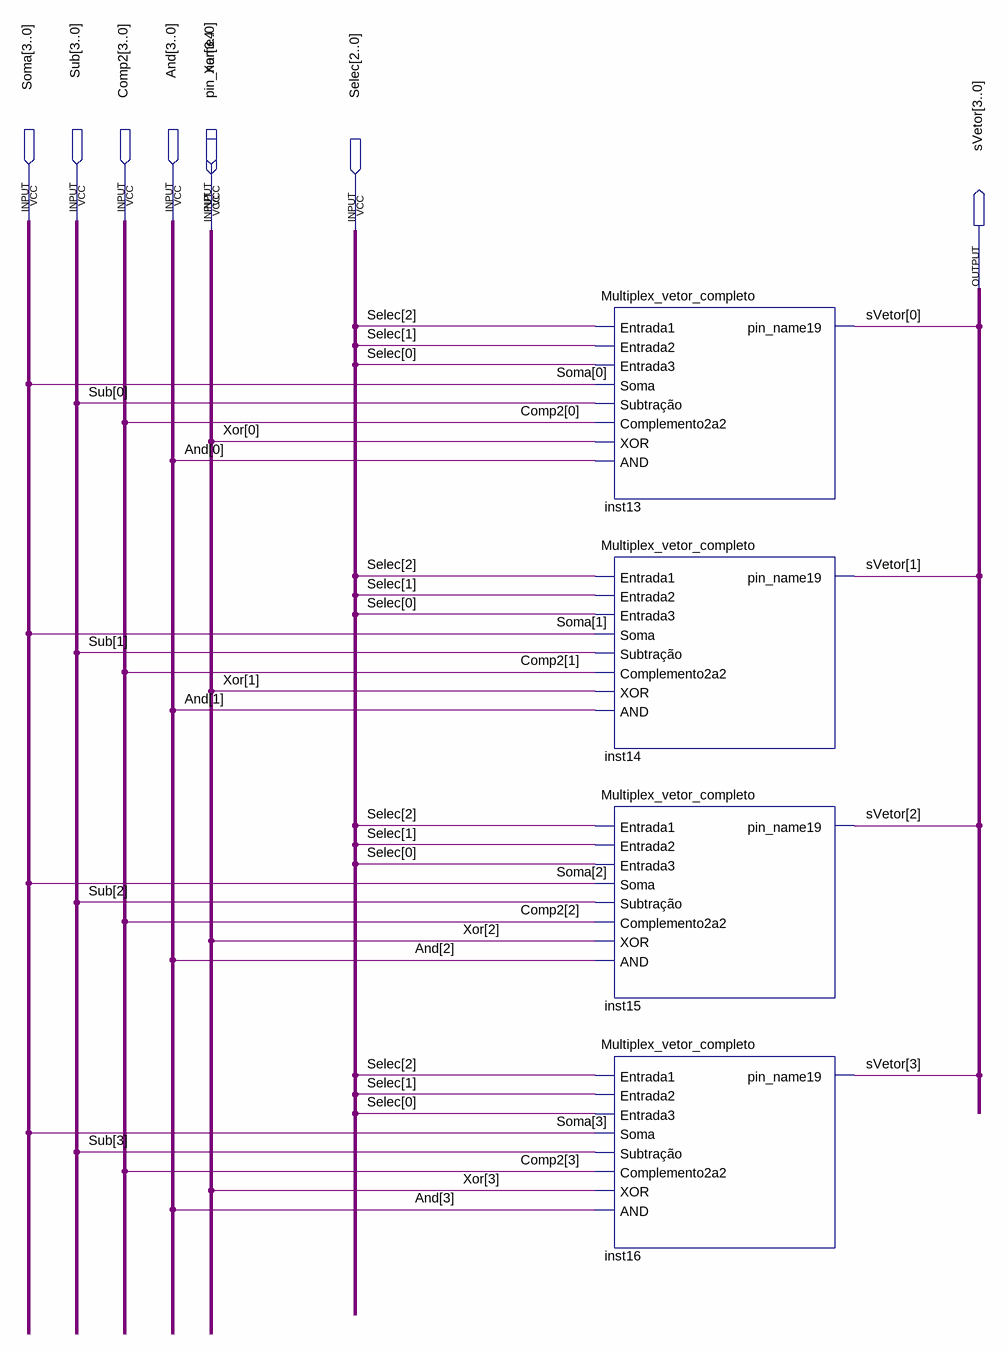
[diagram p0: schematic sheet]
// Quartus schematic Multiplex_vetor_real_completo.bdf as structural Verilog: 4 symbols, 8 pins
module Multiplex_vetor_real_completo (
  input  [3:0] Soma,
  input  [3:0] Sub,
  input  [3:0] Comp2,
  input  [3:0] And,
  input  [3:0] Xor,
  input  pin_name4,
  input  [2:0] Selec,
  output [3:0] sVetor
);

  Multiplex_vetor_completo inst13 (
    .Entrada1(Selec[2]), .Entrada2(Selec[1]), .Entrada3(Selec[0]), .Soma(Soma[0]), .\Subtração (Sub[0]),
    .Complemento2a2(Comp2[0]), .XOR(Xor[0]), .AND(And[0]), .pin_name19(sVetor[0]));
  Multiplex_vetor_completo inst14 (
    .Entrada1(Selec[2]), .Entrada2(Selec[1]), .Entrada3(Selec[0]), .Soma(Soma[1]), .\Subtração (Sub[1]),
    .Complemento2a2(Comp2[1]), .XOR(Xor[1]), .AND(And[1]), .pin_name19(sVetor[1]));
  Multiplex_vetor_completo inst15 (
    .Entrada1(Selec[2]), .Entrada2(Selec[1]), .Entrada3(Selec[0]), .Soma(Soma[2]), .\Subtração (Sub[2]),
    .Complemento2a2(Comp2[2]), .XOR(Xor[2]), .AND(And[2]), .pin_name19(sVetor[2]));
  Multiplex_vetor_completo inst16 (
    .Entrada1(Selec[2]), .Entrada2(Selec[1]), .Entrada3(Selec[0]), .Soma(Soma[3]), .\Subtração (Sub[3]),
    .Complemento2a2(Comp2[3]), .XOR(Xor[3]), .AND(And[3]), .pin_name19(sVetor[3]));
endmodule
